# Altium schematic sheet 03_01_MCU.SchDoc: MCU
size A4; Author: Gabriel; Organization: Altium Limited; Address1: L3, 12a Rodborough Rd; Address2: Frenchs Forest; Address3: NSW; Address4: Australia 2086; SheetNumber: 1; SheetTotal: 1; Subtitle: XDRONE
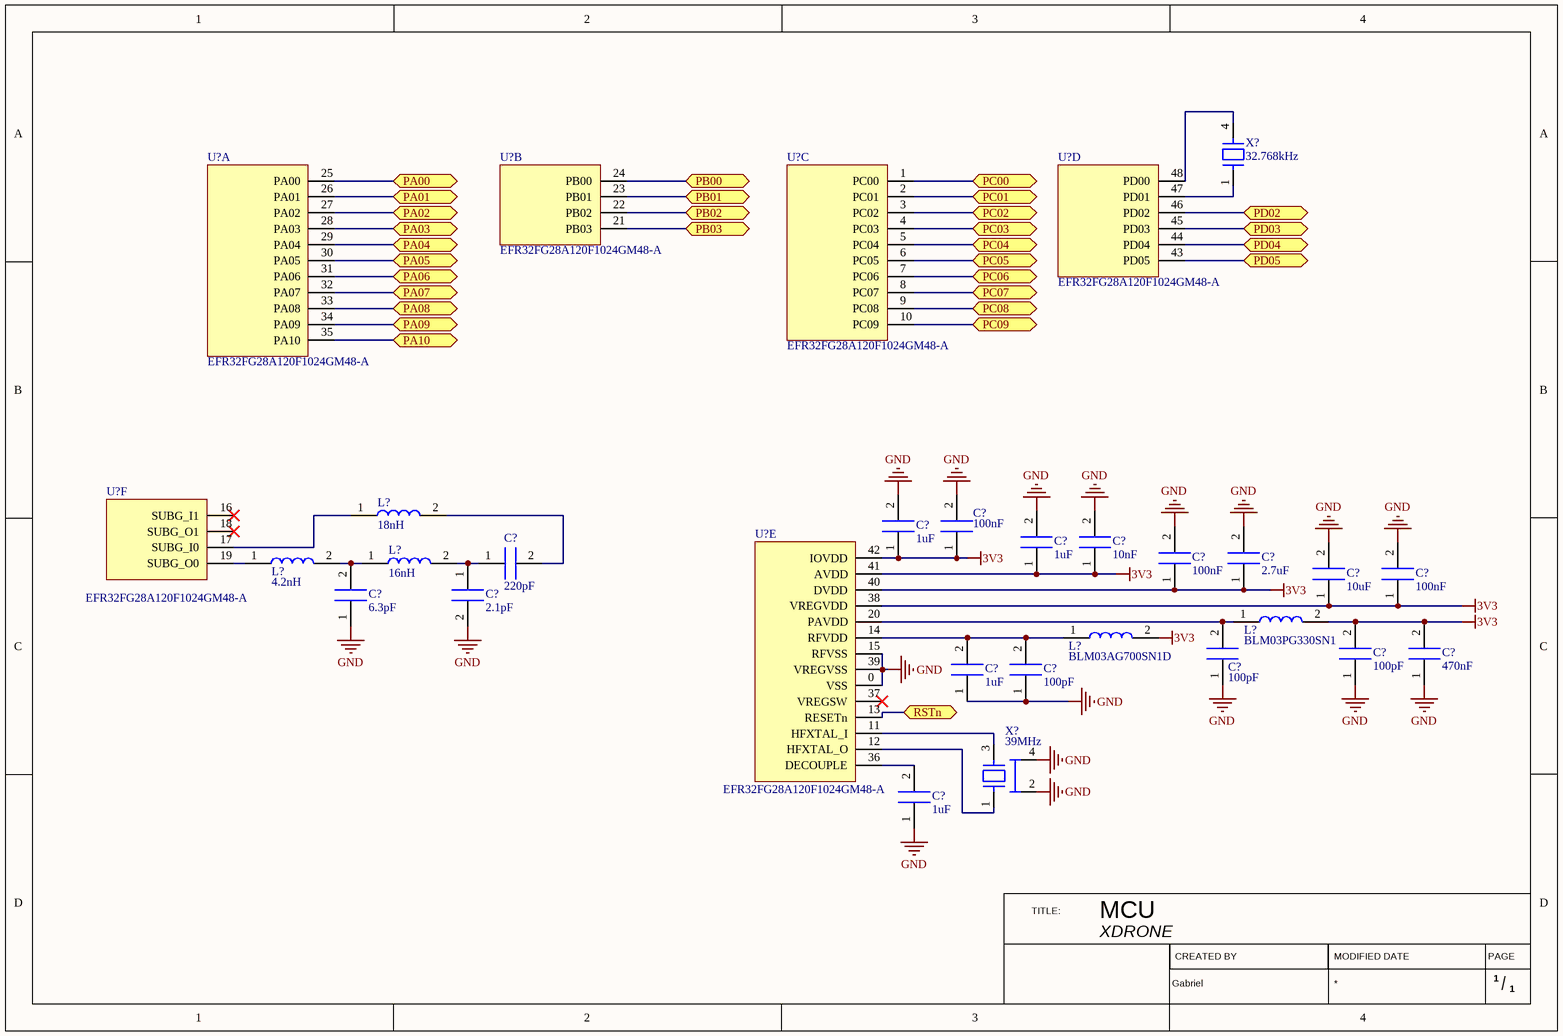
[diagram p0: 03_01_MCU.SchDoc]

## Parts
(Parts that share a designator on the sheet are numbered #1, #2 ... from top to bottom, then left to right.)
C?#1  value 1uF  [CAP_0402]  (hidden comment: 1uF_10%_35V_0402_GRM155R6YA105KE11J)
C?#2  value 100nF  [CAP_0402]  (hidden comment: 100nF_10%_16V_0402_GRM155R71C104KA88J)
C?#3  value 1uF  [CAP_0402]  (hidden comment: 1uF_10%_35V_0402_GRM155R6YA105KE11J)
C?#4  value 10nF  [CAP_0402]  (hidden comment: 10nF_10%_6.3V_0402_CC0402KRX7R5BB103)
C?#5  value 100nF  [CAP_0402]  (hidden comment: 100nF_10%_16V_0402_GRM155R71C104KA88J)
C?#6  value 2.7uF  [CAP_0805]  (hidden comment: 2.7uF_10%_10V_0805_X5R_C0805C275K8PAC7800)
C?#7  value 220pF  [CAP_0805]  (hidden comment: 220pF_5%_50V_0805_C0G,NP0_QSCT251Q221J1GV001E)
C?#8  value 10uF  [CAP_0402]  (hidden comment: 10uF_20%_6.3V_0402_GRM155R60J106ME05D)
C?#9  value 100nF  [CAP_0402]  (hidden comment: 100nF_10%_16V_0402_GRM155R71C104KA88J)
C?#10  value 6.3pF  [CAP_0402]  (hidden comment: 6.3pF_1.5%_50V_0402_CBR04C639B5GAC)
C?#11  value 2.1pF  [CAP_0402]  (hidden comment: 2.1pF_5%_50V_0402_GJM1555C1H2R1BB01D)
C?#12  value 100pF  [CAP_0402]  (hidden comment: 100pF_5%_50V_0402_CC0402JRNPO9BN101)
C?#13  value 100pF  [CAP_0402]  (hidden comment: 100pF_5%_50V_0402_CC0402JRNPO9BN101)
C?#14  value 470nF  [CAP_0402]  (hidden comment: 470nF_10%_6.3V_0402_GCM1555C1H101JA16D)
C?#15  value 1uF  [CAP_0402]  (hidden comment: 1uF_10%_35V_0402_GRM155R6YA105KE11J)
C?#16  value 100pF  [CAP_0402]  (hidden comment: 100pF_5%_50V_0402_CC0402JRNPO9BN101)
C?#17  value 1uF  [CAP_0402]  (hidden comment: 1uF_10%_35V_0402_GRM155R6YA105KE11J)
L?#1  value 18nH  [RF_IND_0402]  (hidden comment: 18nH_2%_400mA_LQG15HS18NG02D)
L?#2  value 4.2nH  [RF_IND_0402]  (hidden comment: 4.2nH_5%_1.8A_LQW15AN4N2C8ZD)
L?#3  value 16nH  [RF_IND_0402]  (hidden comment: 16nH_3%_400mA_MLG1005S16NHT000)
L?#4  MANUFACTURER REFERENCE: BLM03PG330SN1  [IND_0201]  (hidden comment: 52nH_25%_750mA_BLM03PG330SN1)
L?#5  MANUFACTURER REFERENCE: BLM03AG700SN1D  [IND_0201]  (hidden comment: 110nH_50%_200mA_BLM03AG700SN1D)
U?#1  MANUFACTURER REFERENCE: EFR32FG28A120F1024GM48-A  [QFN48 0606]  (hidden comment: MCU_1MB_256kB_EFR32FG28A120F1024GM48-A)  (part A of 6)
U?#2  MANUFACTURER REFERENCE: EFR32FG28A120F1024GM48-A  [QFN48 0606]  (hidden comment: MCU_1MB_256kB_EFR32FG28A120F1024GM48-A)  (part B of 6)
U?#3  MANUFACTURER REFERENCE: EFR32FG28A120F1024GM48-A  [QFN48 0606]  (hidden comment: MCU_1MB_256kB_EFR32FG28A120F1024GM48-A)  (part C of 6)
U?#4  MANUFACTURER REFERENCE: EFR32FG28A120F1024GM48-A  [QFN48 0606]  (hidden comment: MCU_1MB_256kB_EFR32FG28A120F1024GM48-A)  (part D of 6)
U?#5  MANUFACTURER REFERENCE: EFR32FG28A120F1024GM48-A  [QFN48 0606]  (hidden comment: MCU_1MB_256kB_EFR32FG28A120F1024GM48-A)  (part F of 6)
U?#6  MANUFACTURER REFERENCE: EFR32FG28A120F1024GM48-A  [QFN48 0606]  (hidden comment: MCU_1MB_256kB_EFR32FG28A120F1024GM48-A)  (part E of 6)
X?#1  FREQUENCY: 32.768kHz  [QUARTZ_4-SOJ_5.5mm]  (hidden comment: QUARTZ_32.768kHz_20ppm_830016178)
X?#2  FREQUENCY: 39MHz  [QUARTZ_4-SMD]  (hidden comment: QUARTZ_39MHz_10ppm_ECS-390-10-37B-CKM-TR)

## Ports
PA00, PA01, PA02, PA03, PA04, PA05, PA06, PA07, PA08, PA09, PA10, PB00, PB01, PB02, PB03, PC00, PC01, PC02, PC03, PC04, PC05, PC06, PC07, PC08, PC09, PD02, PD03, PD04, PD05, RSTn

## Nets
3V3: C?#1.1 C?#2.1 C?#3.1 C?#4.1 C?#5.1 C?#6.1 C?#8.1 C?#9.1 C?#13.2 C?#14.2 L?#4.2 L?#5.2 U?#6.38(VREGVDD) U?#6.40(DVDD) U?#6.41(AVDD) U?#6.42(IOVDD)
GND: C?#1.2 C?#2.2 C?#3.2 C?#4.2 C?#5.2 C?#6.2 C?#8.2 C?#9.2 C?#10.1 C?#11.2 C?#12.1 C?#13.1 C?#14.1 C?#15.1 C?#16.1 C?#17.1 U?#6.0(VSS) U?#6.15(RFVSS) U?#6.39(VREGVSS) X?#2.2 X?#2.4
PA00: U?#1.25(PA00) ; port PA00
PA01: U?#1.26(PA01) ; port PA01
PA02: U?#1.27(PA02) ; port PA02
PA03: U?#1.28(PA03) ; port PA03
PA04: U?#1.29(PA04) ; port PA04
PA05: U?#1.30(PA05) ; port PA05
PA06: U?#1.31(PA06) ; port PA06
PA07: U?#1.32(PA07) ; port PA07
PA08: U?#1.33(PA08) ; port PA08
PA09: U?#1.34(PA09) ; port PA09
PA10: U?#1.35(PA10) ; port PA10
PB00: U?#2.24(PB00) ; port PB00
PB01: U?#2.23(PB01) ; port PB01
PB02: U?#2.22(PB02) ; port PB02
PB03: U?#2.21(PB03) ; port PB03
PC00: U?#3.1(PC00) ; port PC00
PC01: U?#3.2(PC01) ; port PC01
PC02: U?#3.3(PC02) ; port PC02
PC03: U?#3.4(PC03) ; port PC03
PC04: U?#3.5(PC04) ; port PC04
PC05: U?#3.6(PC05) ; port PC05
PC06: U?#3.7(PC06) ; port PC06
PC07: U?#3.8(PC07) ; port PC07
PC08: U?#3.9(PC08) ; port PC08
PC09: U?#3.10(PC09) ; port PC09
PD02: U?#4.46(PD02) ; port PD02
PD03: U?#4.45(PD03) ; port PD03
PD04: U?#4.44(PD04) ; port PD04
PD05: U?#4.43(PD05) ; port PD05
RSTn: U?#6.13(RESETn) ; port RSTn
NetC?#7_1: C?#7.1 C?#11.1 L?#3.2
NetC?#7_2: C?#7.2 L?#1.2
NetC?#10_2: C?#10.2 L?#2.2 L?#3.1
NetC?#12_2: C?#12.2 L?#4.1 U?#6.20(PAVDD)
NetC?#15_2: C?#15.2 C?#16.2 L?#5.1 U?#6.14(RFVDD)
NetC?#17_2: C?#17.2 U?#6.36(DECOUPLE)
NetL?#1_1: L?#1.1 U?#5.17(SUBG_I0)
NetL?#2_1: L?#2.1 U?#5.19(SUBG_O0)
NetU?#4_47: U?#4.47(PD01) X?#1.1
NetU?#4_48: U?#4.48(PD00) X?#1.4
NetU?#6_11: U?#6.11(HFXTAL_I) X?#2.3
NetU?#6_12: U?#6.12(HFXTAL_O) X?#2.1

Not connected (* = marked no-connect by the designer): U?#5 16(SUBG_I1)* 18(SUBG_O1)*; U?#6 37(VREGSW)*

## Notes on the sheet
- TITLE:
- CREATED BY
- MODIFIED DATE
- PAGE
- /

## Library data of the parts
C?#1 C?#3 C?#15 C?#17 = 1uF_10%_35V_0402_GRM155R6YA105KE11J: CAPACITOR 1uF 10% X5R 0402; MANUFACTURER: MURATA; VOLTAGE RATING: 35V; DIELECTRIC: X5R; TOLERANCE: 10%; PACKAGING: 0402; MOUNTING: SMD; MANUFACTURER REFERENCE: GRM155R6YA105KE11J
C?#2 C?#5 C?#9 = 100nF_10%_16V_0402_GRM155R71C104KA88J: CAPACITOR 100nF 10% X7R 0402; MANUFACTURER: MURATA; DIELECTRIC: X5R; VOLTAGE RATING: 16V; TOLERANCE: 10%; PACKAGING: 0402; MOUNTING: SMD; MANUFACTURER REFERENCE: GRM155R71C104KA88J
C?#4 = 10nF_10%_6.3V_0402_CC0402KRX7R5BB103: CAPACITOR 10nF 10% 6.3V 0402 CC0402KRX7R5BB103; MANUFACTURER: YAGEO; DIELECTRIC: X7R; TOLERANCE: 10%; VOLTAGE RATING: 6.3V; PACKAGING: 0402; MOUNTING: SMD; MANUFACTURER REFERENCE: CC0402KRX7R5BB103
C?#6 = 2.7uF_10%_10V_0805_X5R_C0805C275K8PAC7800: CAP 2.7uF 10% 10V 0805 X5R C0805C275K8PAC7800; MANUFACTURER: KEMET; DIELECTRIC: X5R; TOLERANCE: 10%; VOLTAGE RATING: 10V; PACKAGING: 0805; MOUNTING: SMD; MANUFACTURER REFERENCE: C0805C275K8PAC7800
C?#7 = 220pF_5%_50V_0805_C0G,NP0_QSCT251Q221J1GV001E: CAP 220pF 5% 50V 0805 C0G,NP0; MANUFACTURER: JOHANSON TECHLONOGY; DIELECTRIC: C0G, NP0; TOLERANCE: 5%; VOLTAGE RATING: 50V; PACKAGING: 0805; MOUNTING: SMD; MANUFACTURER REFERENCE: QSCT251Q221J1GV001E
C?#8 = 10uF 20% 6.3V 0402 GRM155R60J106ME05D: CAPACITOR 10uF 20% 6.3V 0402 GRM155R60J106ME05D; MANUFACTURER: MURATA; DIELECTRIC: X5R; TOLERANCE: 20%; VOLTAGE RATING: 6.3V; PACKAGING: 0402; MOUNTING: SMD; MANUFACTURER REFERENCE: GRM155R60J106ME05D
C?#10 = 6.3pF_1.5%_50V_0402_CBR04C639B5GAC: CAPACITOR 6.3pF 1.5% 50V 0402 CBR04C639B5GAC; MANUFACTURER: KEMET; DIELECTRIC: C0G, NP0; TOLERANCE: 1.5%; VOLTAGE RATING: 50V; PACKAGING: 0402; MOUNTING: SMD; MANUFACTURER REFERENCE: CBR04C639B5GAC
C?#11 = 2.1pF_5%_50V_0402_GJM1555C1H2R1BB01D: CAPACITOR 2.1pF 5% 50V 0402 GJM1555C1H2R1BB01D; MANUFACTURER: MURATA; DIELECTRIC: C0G, NP0; TOLERANCE: 5%; VOLTAGE RATING: 50V; PACKAGING: 0402; MOUNTING: SMD; MANUFACTURER REFERENCE: GJM1555C1H2R1BB01D
C?#12 C?#13 C?#16 = 100pF_5%_50V_0402_CC0402JRNPO9BN101: CAPACITOR 100pF 5% 50V 0402 CC0402JRNPO9BN101; MANUFACTURER: YAGEO; DIELECTRIC: C0G, NP0; TOLERANCE: 5%; VOLTAGE RATING: 50V; PACKAGING: 0402; MOUNTING: SMD; MANUFACTURER REFERENCE: CC0402JRNPO9BN101
C?#14 = 470nF_10%_6.3V_0402_GCM1555C1H101JA16D: CAPACITOR 470nF 10% 6.3V 0402 GCM1555C1H101JA16D; MANUFACTURER: MURATA; DIELECTRIC: X6S; TOLERANCE: 5%; VOLTAGE RATING: 6.3V; PACKAGING: 0402; MOUNTING: SMD; MANUFACTURER REFERENCE: GCM1555C1H101JA16D
L?#1 = 18nH_2%_400mA_LQG15HS18NG02D: INDUCTOR 18nH 2% 400mA LQG15HS18NG02D; MANUFACTURER: MURATA; TOLERANCE: 2%; PACKAGING: 0402; MOUNTING: SMD; CURRENT RATING: 400mA; MANUFACTURER REFERENCE: LQG15HS18NG02D
L?#2 = 4.2nH_5%_1.8A_LQW15AN4N2C8ZD: INDUCTOR 4.2nH 5% 1.8A LQW15AN4N2C8ZD; MANUFACTURER: MURATA; TOLERANCE: 5%; PACKAGING: 0402; MOUNTING: SMD; CURRENT RATING: 1.8A; MANUFACTURER REFERENCE: LQW15AN4N2C8ZD
L?#3 = 16nH_3%_400mA_MLG1005S16NHT000: INDUCTOR 16nH 3% 400mA MLG1005S16NHT000; MANUFACTURER: TDK; TOLERANCE: 3%; PACKAGING: 0402; MOUNTING: SMD; CURRENT RATING: 400mA; MANUFACTURER REFERENCE: MLG1005S16NHT000
L?#4 = 52nH_25%_750mA_BLM03PG330SN1: INDUCTOR 52uH 25% 750mA BLM03PG330SN1; MANUFACTURER: MURATA; VALUE: 52nF; TOLERANCE: 25%; PACKAGING: 0201; MOUNTING: SMD; CURRENT RATING: 750mA
L?#5 = 110nH 50% 200mA BLM03AG700SN1D: INDUCTOR 110nH 50% 200mA BLM03AG700SN1D; MANUFACTURER: MURATA; TOLERANCE: 50%; PACKAGING: 0201; MOUNTING: SMD; CURRENT RATING: 200mA; VALUE: 110nH
U?#1-U?#6 = MCU_1MB_256kB_EFR32FG28A120F1024GM48-A: MCU 1MB 256kB EFR32FG28A120F1024GM48-A; MANUFACTURER: SILICON LABS; PACKAGING: QFN48 0606; FLASH SIZE: 1 MB; RAM SIZE: 256 KB; PIN COUNT: 48
X?#1 = QUARTZ_32.768kHz_20ppm_830016178: QUARTZ 32.768kHz 20ppm 830016178; MANUFACTURER: WURTH; MANUFACTURER REFERENCE: 830016178; MOUNTING: SMD; PACKAGING: 4-SOJ; TOLERANCE: 20 ppm
X?#2 = QUARTZ_39MHz_10ppm_ECS-390-10-37B-CKM-TR: QUARTZ 39MHz 10ppm ECS-390-10-37B-CKM-TR; MANUFACTURER: ECS; MANUFACTURER REFERENCE: ECS-390-10-37B-CKM-TR; MOUNTING: SMD; PACKAGING: 4-SMD; TOLERANCE: 10 ppm; STABILITY: 10 ppm